# EAGLE design 4-port (EAGLE 7.6.0)
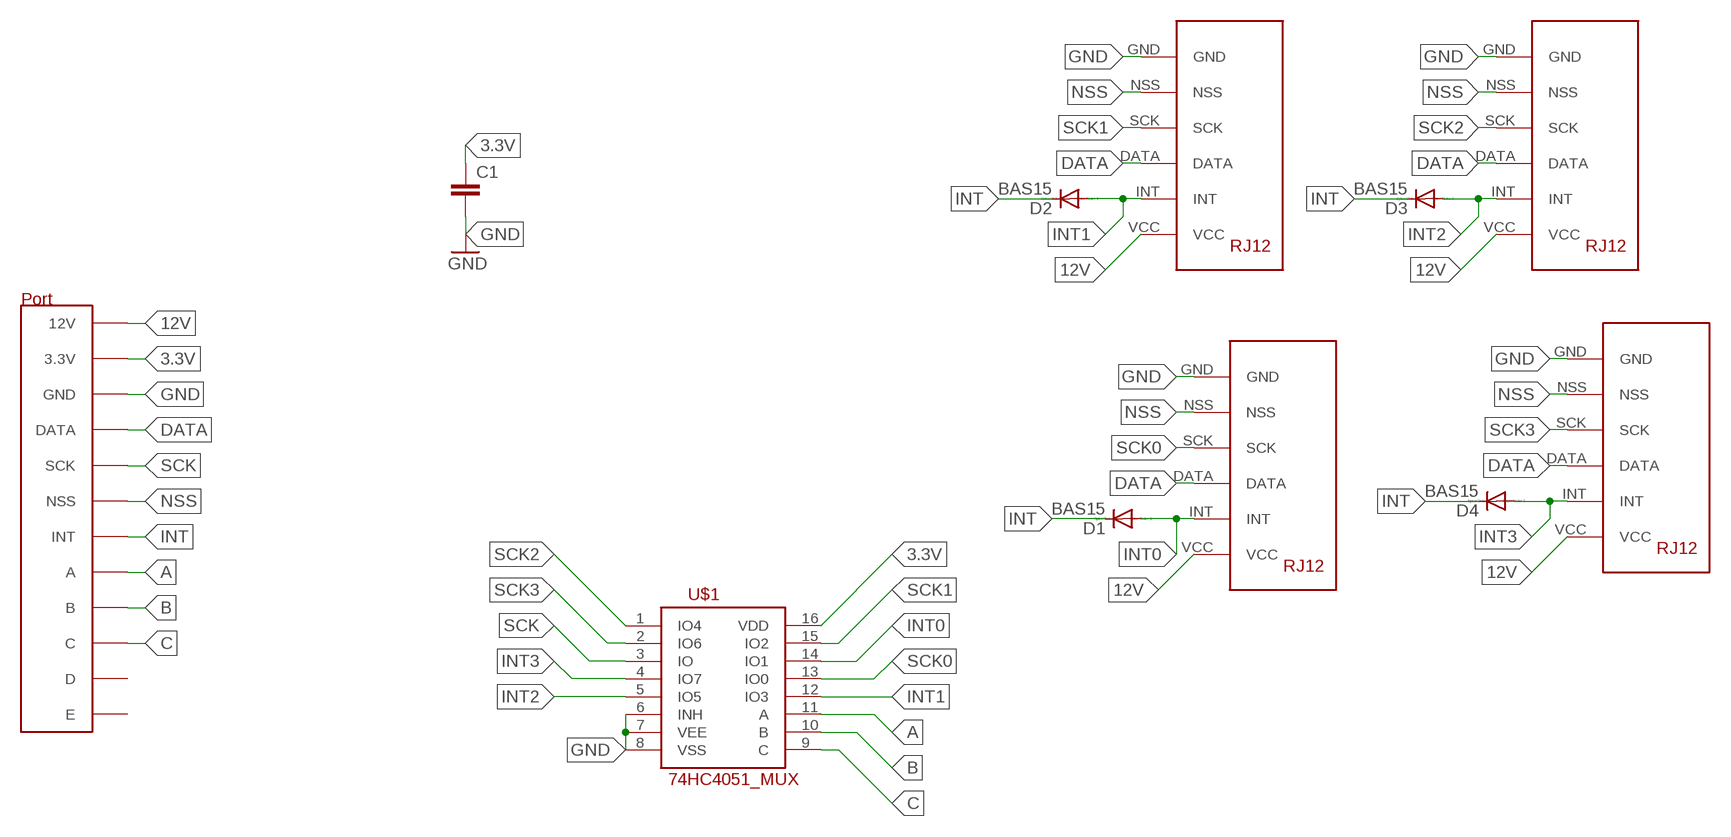
[diagram p0: schematic, sheet 1]

## Parts
C1  C-EUC1206  [C1206]
D1  BAS15  [DO34-7]
D2  BAS15  [DO34-7]
D3  BAS15  [DO34-7]
D4  BAS15  [DO34-7]
U$1  74HC4051_MUX  [SO16]
U$2  RJ12SMD  [RJ12_SMD]
U$3  HUB_PORT  [HUB_PORT]
U$4  RJ12SMD  [RJ12_SMD]
U$5  RJ12SMD  [RJ12_SMD]
U$7  RJ12SMD  [RJ12_SMD]

## Nets
3.3V: C1.1 U$1.16(VDD) U$3.3.3V
12V: U$2.VCC U$3.12V U$4.VCC U$5.VCC U$7.VCC
A: U$1.11(A) U$3.A
B: U$1.10(B) U$3.B
C: U$1.9(C) U$3.C
DATA: U$2.DATA U$3.DATA U$4.DATA U$5.DATA U$7.DATA
GND: C1.2 U$1.6(INH) U$1.7(VEE) U$1.8(VSS) U$2.GND U$3.GND U$4.GND U$5.GND U$7.GND
INT: D1.C D2.C D3.C D4.C U$3.INT
INT0: D1.A U$1.14(IO1) U$2.INT
INT1: D2.A U$1.12(IO3) U$4.INT
INT2: D3.A U$1.5(IO5) U$5.INT
INT3: D4.A U$1.4(IO7) U$7.INT
NSS: U$2.NSS U$3.NSS U$4.NSS U$5.NSS U$7.NSS
SCK: U$1.3(IO) U$3.SCK
SCK0: U$1.13(IO0) U$2.SCK
SCK1: U$1.15(IO2) U$4.SCK
SCK2: U$1.1(IO4) U$5.SCK
SCK3: U$1.2(IO6) U$7.SCK
Unconnected: U$3.D U$3.E

## Library data of the parts
C1 = resistor:C-EU: CAPACITOR, European symbol
D1-D4 = diode:BAS15: DIODE high speed
U$1 = SparkFun-AnalogIC:74HC4051_MUX: 8:1 analog mux
U$2 U$4 U$5 U$7 = gumyns:RJ12
U$3 = gumyns:HUB_PORT

## Board
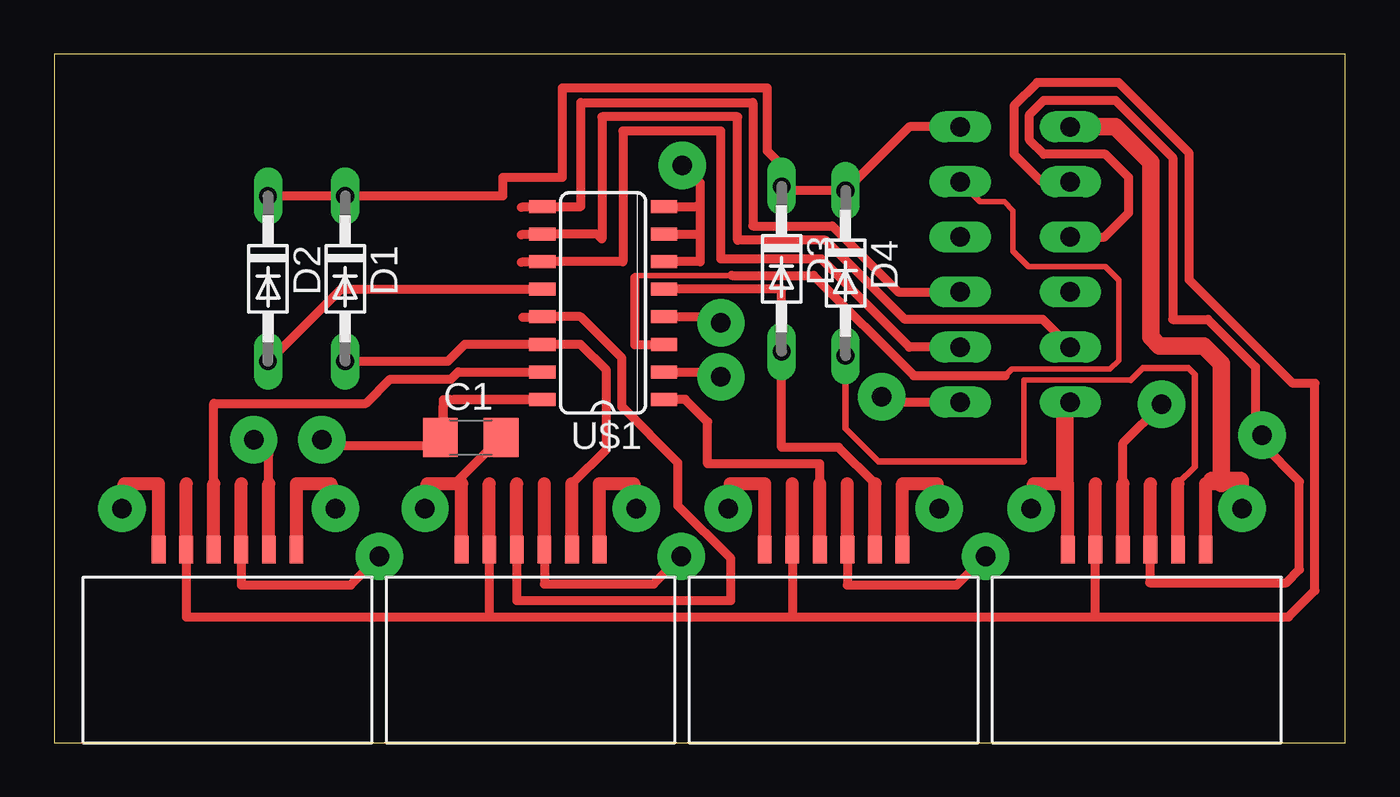
[diagram p1: board, top side]
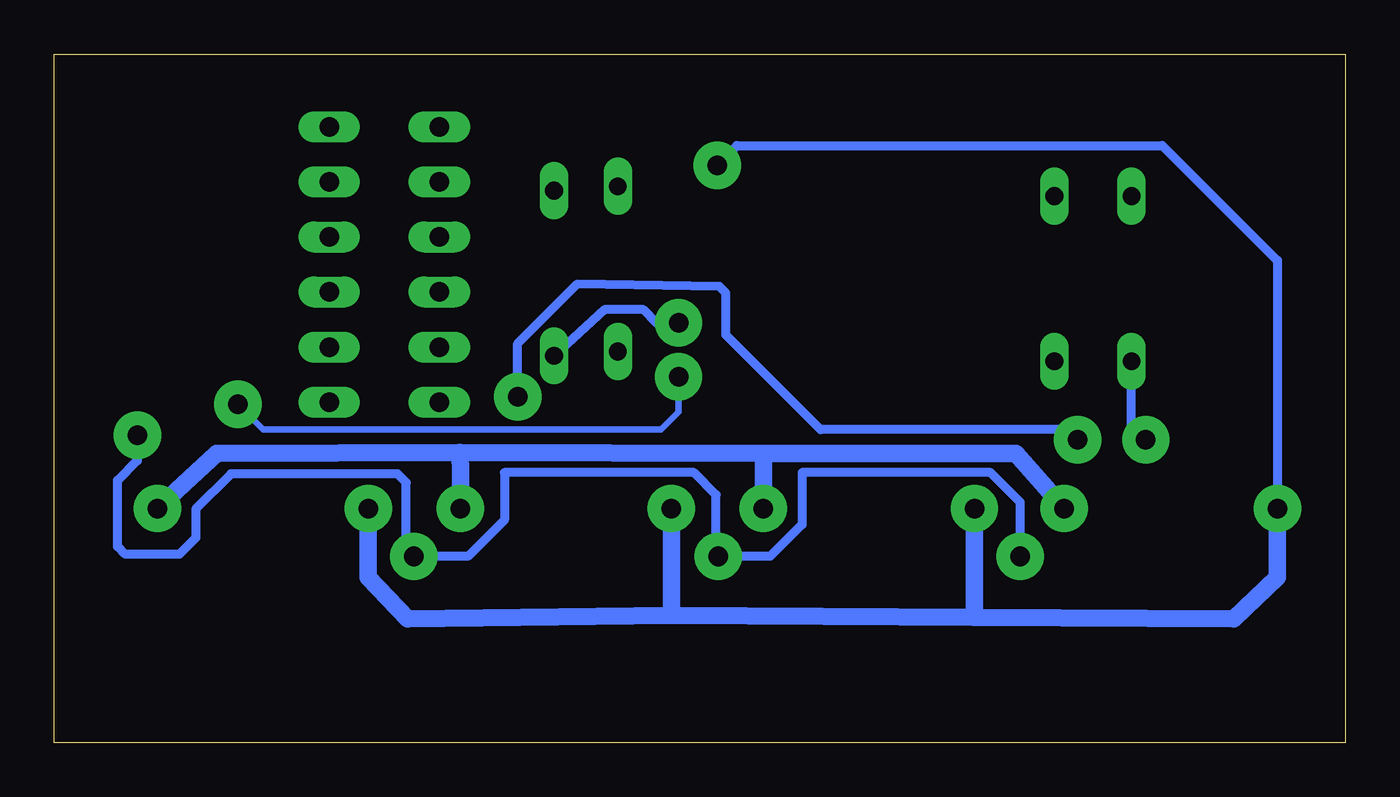
[diagram p2: board, bottom side, seen from below]

Size 59.51 x 31.74 mm. Coordinates in mm from the lower left corner, seen from the top.
Outline: 0,0 59.51,0 59.51,31.74 0,31.74 0,0
Copper layers (1*16): Top 0.035mm / dielectric 1.5mm / Bottom 0.035mm
Design rules "default": minimum track width 10mil, minimum drill 24mil, track to track 8mil, track to pad 8mil, pad to pad 8mil, via to via 8mil, smd to smd 8mil, copper to edge 40mil, drill to drill 8mil, minimum pad ring 10mil, minimum via ring 8mil, stop-mask expansion 4mil, vias tented up to drill 0mil, thermal gap 10mil

### Footprints (pad centres in the part's own frame; a part is rotated, then mirrored left to right if it is on the bottom)
C1206 = smd 1.6 x 1.8: 1 -1.4,0; 2 1.4,0
DO34-7 = drill 0.813 long: A 3.81,0; C -3.81,0
SO16 = smd 0.6 x 1.2: 1 -4.445,-2.8; 2 -3.175,-2.8; 3 -1.905,-2.8; 4 -0.635,-2.8; 5 0.635,-2.8; 6 1.905,-2.8; 7 3.175,-2.8; 8 4.445,-2.8; 9 4.445,2.8; 10 3.175,2.8; 11 1.905,2.8; 12 0.635,2.8; 13 -0.635,2.8; 14 -1.905,2.8; 15 -3.175,2.8; 16 -4.445,2.8
RJ12_SMD = smd 0.635 x 1.27: DATA 0.953,5.08; GND -2.857,5.08; INT 2.223,5.08; NSS -1.587,5.08; SCK -0.318,5.08; VCC 3.493,5.08
HUB_PORT = drill 0.9 pad 1.422 long: 3.3V -2.54,2.54; 12V 10.16,-2.54; A 0,2.54; B 0,-2.54; C 2.54,2.54; D 2.54,-2.54; DATA 5.08,-2.54; E 5.08,2.54; GND -2.54,-2.54; INT 10.16,2.54; NSS 7.62,-2.54; SCK 7.62,2.54

### Placement (x,y rotation side)
C1  19.2,14.07 0 top
D1  13.41,21.39 270 top
D2  9.86,21.39 270 top
D3  33.53,21.84 270 top
D4  36.47,21.64 270 top
U$1  25.3,20.27 90 top
U$2  21.64,3.81 0 top
U$3  44.3,18.24 90 top
U$4  7.67,3.81 0 top
U$5  35.61,3.81 0 top
U$7  49.58,3.81 0 top

### Tracks (layer width: path | path; a pad name or v marks a point on that pad's centre or on a via)
3.3V  (via drill 0.9 pad 2.18)
  Top 0.406: C1.1 17.93,14.2 17.93,15.54 18.21,15.82 U$1.16 18.44,15.82 18.44,15.8 17.93,15.8 17.93,13.66 12.34,13.66 v12.34,13.97 | v38.15,15.95 38.4,15.7 U$3.3.3V
  Bottom 0.406: v12.34,13.97 12.8,14.43 24.18,14.43 28.55,18.8 28.55,20.73 28.85,21.03 35.41,21.13 38.15,18.39 v38.15,15.95
12V  (via drill 0.9 pad 2.18)
  Top 0.61: 53.07,11.94 53.8,11.94 54.66,11.94 54.67,11.82 v54.76,10.79 | 39.1,11.94 40.69,11.94 v40.79,10.79 | 25.13,11.94 26.72,11.94 v26.82,10.79 | 11.16,11.94 12.75,11.94 v12.95,10.79
  Top 0.813: 53.36,12.1 54.67,12.1 54.67,11.82 | U$3.12V 48.92,28.4 50.55,26.77 50.55,18.69 50.95,18.29 52.98,18.29 53.8,17.48 53.8,11.94
  Bottom 0.813: v12.95,10.79 15.19,13.34 26.82,13.34 | 26.82,13.34 40.82,13.39 | 40.82,13.39 52.02,13.34 v54.76,10.79 | v26.82,10.79 26.82,13.34 | v40.79,10.79 40.79,12.7 40.82,13.39
A
  Top 0.406: U$3.A 39.42,18.24 35.36,22.3 30.73,22.3 30.73,28.19 26.21,28.19 26.21,22.17 U$1.11 arc90 22.52,22.15 | 22.52,22.15 21.54,22.15 | 22.55,22.15 22.52,22.15
B
  Top 0.406: U$3.B 45.57,19.51 39.22,19.51 35.56,23.16 31.5,23.16 31.5,28.85 25.25,28.85 25.25,23.22 25.02,23.44 U$1.10 22.5,23.43 arc90 22.5,23.42 21.54,23.42
C
  Top 0.406: U$3.C 38.91,20.78 35.86,23.82 32.21,23.82 32.21,29.52 24.28,29.52 24.28,24.71 U$1.9 22.53,24.71 arc-90 22.55,24.69 | 22.71,24.69 22.55,24.69 | 22.55,24.69 21.54,24.69
DATA  (via drill 0.9 pad 2.18)
  Top 0.406: U$4.DATA 8.62,7.26 13.66,7.26 v14.99,8.59 | U$2.DATA 22.59,7.32 27.63,7.32 v28.9,8.59 | U$5.DATA 36.56,7.26 41.6,7.26 v42.93,8.59 | 50.53,11.94 50.49,11.9 50.49,7.37 56.79,7.37 57.4,7.98 57.4,12.04 55.68,13.77 v55.68,14.17 55.37,14.48 55.37,17.32 53.19,19.51 51.56,19.51 51.56,26.98 48.92,29.62 45.62,29.62 44.96,28.96 44.96,27.79 45.62,27.13 48.46,27.13 49.53,26.06 49.53,24.43 48.41,23.32 U$3.DATA
  Bottom 0.406: v14.99,8.59 14.99,11.07 16.36,12.45 25.04,12.45 25.04,10.06 26.52,8.59 v28.9,8.59 29.01,8.69 29.01,11.43 30.02,12.45 38.76,12.45 38.76,10.26 40.44,8.59 v42.93,8.59 43.28,8.94 43.28,11.99 43.69,12.39 51.36,12.39 52.98,10.77 52.98,9.45 53.75,8.69 56.24,8.69 56.59,9.04 56.59,12.09 55.68,13.01 v55.68,14.17
GND  (via drill 0.9 pad 2.18)
  Top 0.406: 29.77,24.54 29.77,25.3 29.77,25.55 29.77,25.81 v28.96,26.62 | 29.77,24.54 29.77,23.44 | 29.77,23.44 29.77,22.17 U$1.6 | U$1.8 29.59,24.71 arc-90 29.77,24.54 | U$1.7 29.77,23.44 | C1.2 18.47,11.94 18.44,11.94
  Top 0.61: v3.12,10.79 3.23,11.94 4.81,11.94 | v17.09,10.79 17.2,11.94 18.44,11.94 18.78,11.94 | v31.06,10.79 31.17,11.94 32.75,11.94 | v45.03,10.79 45.14,11.94 46.58,11.94 46.72,11.94
  Top 0.813: 45.06,10.79 v45.03,10.79 | U$3.GND 46.58,15.7 46.58,11.94
  Bottom 0.406: v28.96,26.62 28.04,27.53 8.43,27.53 3.12,22.23 3.12,10.26
  Bottom 0.813: v3.12,10.79 3.12,10.26 3.12,7.62 5.13,5.71 17.09,5.77 | 17.09,5.77 31.06,5.87 | 31.06,5.87 43.23,5.71 45.03,7.62 v45.03,10.79 | v17.09,10.79 17.09,5.77 | v31.06,10.79 31.06,5.87
INT
  Top 0.406: U$3.INT 39.42,28.4 D4.C 33.73,25.45 D3.C 33.53,26.62 32.87,27.28 32.87,30.18 23.42,30.18 23.42,26.06 20.68,26.06 20.68,25.2 D1.C D2.C
INT0
  Top 0.406: 23.86,11.94 25.45,13.53 25.45,17.17 24.26,18.36 U$1.14 18.92,18.36 18.14,17.58 D1.A
INT1  (via drill 0.9 pad 2.18)
  Top 0.406: D2.A 9.89,17.58 13.22,20.9 U$1.12 | 9.89,11.94 9.89,13.27 arc90 v9.19,13.97
  Bottom 0.406: v9.19,13.97 9.85,14.63 D2.A
INT2
  Top 0.406: 37.83,11.94 36.16,13.61 33.53,13.61 D3.A 33.53,20.9 U$1.5
INT3  (via drill 0.9 pad 2.18)
  Top 0.254: 49.63,16.71 44.7,16.71 44.7,12.95
  Top 0.305: 51.8,11.94 52.58,12.71 52.58,16.97 52.27,17.27 50.19,17.27 49.63,16.71 | 44.7,12.95 38,12.95 36.47,14.48 D4.A
  Top 0.406: U$1.4 30.73,19.63 v30.73,19.36
  Bottom 0.406: v30.73,19.36 31.75,19.36 32.36,19.96 34.14,19.96 D4.A
NSS
  Top 0.406: U$4.NSS 6.08,5.79 20.05,5.79 | 20.05,5.79 34.02,5.79 | 34.02,5.79 47.99,5.79 | 47.99,5.79 U$7.NSS 47.99,11.94 | U$5.NSS 34.02,5.79 | U$2.NSS 20.05,5.79 | 47.99,5.79 56.9,5.79 58.11,7.01 58.11,16.56 57.1,16.56 52.32,21.34 52.32,27.18 49.07,30.43 45.31,30.43 44.25,29.36 44.25,27.13 45.47,25.91 46.79,25.91 U$3.NSS 46.43,25.86
SCK
  Top 0.254: 26.77,21.44 26.77,21.54 31.24,21.54 | U$3.SCK 42.67,24.94 43.79,24.94 44.2,24.54 44.2,22.66 44.91,21.95 48.46,21.95 49.07,21.34 49.07,17.63 48.67,17.22 44.14,17.22 43.84,16.92
  Top 0.406: U$1.3 28.1,18.34 26.77,18.34 26.77,21.44 | 31.24,21.54 35,21.54 39.62,16.92 43.84,16.92
SCK0
  Top 0.406: 21.32,11.94 21.32,6.55 31.19,6.55 31.19,8.48 28.75,10.92 28.75,12.9 26.16,15.49 26.16,17.73 24.26,19.63 U$1.13 22.43,19.63 arc90 22.4,19.61 21.59,19.61
SCK1
  Top 0.406: U$1.15 18.62,17.09 18.29,16.76 15.49,16.76 14.38,15.65 7.35,15.65 7.35,11.94
SCK2
  Top 0.406: 35.29,11.94 35.29,12.85 30.12,12.85 30.12,14.78 29.08,15.82 U$1.1
SCK3  (via drill 0.9 pad 2.18)
  Top 0.406: 49.26,11.94 49.26,13.8 v51.05,15.6 | U$1.2 30.73,17.09 v30.73,16.87
  Bottom 0.305: v51.05,15.6 49.89,14.43 31.55,14.43 30.73,15.24 v30.73,16.87